# EAGLE design untitled (EAGLE 6.4)
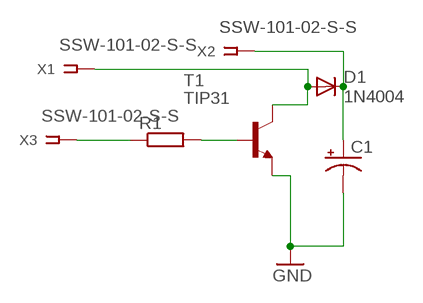
[diagram p0: schematic, sheet 1]

## Parts
C1  CPOL-USE5-5  [E5-5]
D1  1N4004  [DO41-10]
R1  R-EU_0207/10  [0207/10]
T1  TIP31  [TO220]
X1  SSW-101-02-S-S  [SSW-101-02-S-S]
X2  SSW-101-02-S-S  [SSW-101-02-S-S]
X3  SSW-101-02-S-S  [SSW-101-02-S-S]

## Nets
GND: C1.- T1.3(E)
N$1: R1.2 T1.1(B)
N$2: D1.A T1.2(C) X1.1
N$3: C1.+ D1.C X2.1
N$4: R1.1 X3.1

## Library data of the parts
C1 = rcl:CPOL-US: POLARIZED CAPACITOR, American symbol
D1 = diode:1N4004: DIODE general purpose rectifier, 1 A
R1 = rcl:R-EU_: RESISTOR, European symbol
T1 = transistor:TIP31: NPN Transistor Medium Power Linear Switching Applications Source: http://onsemi.com
X1-X3 = con-samtec:SSW-101-02-S-S: THROUGH-HOLE .025" SQ POST SOCKET Source: Samtec SSW.pdf; MPN: SSW-101-02-S-S; OC_FARNELL: unknown; OC_NEWARK: 11P9336

## Board
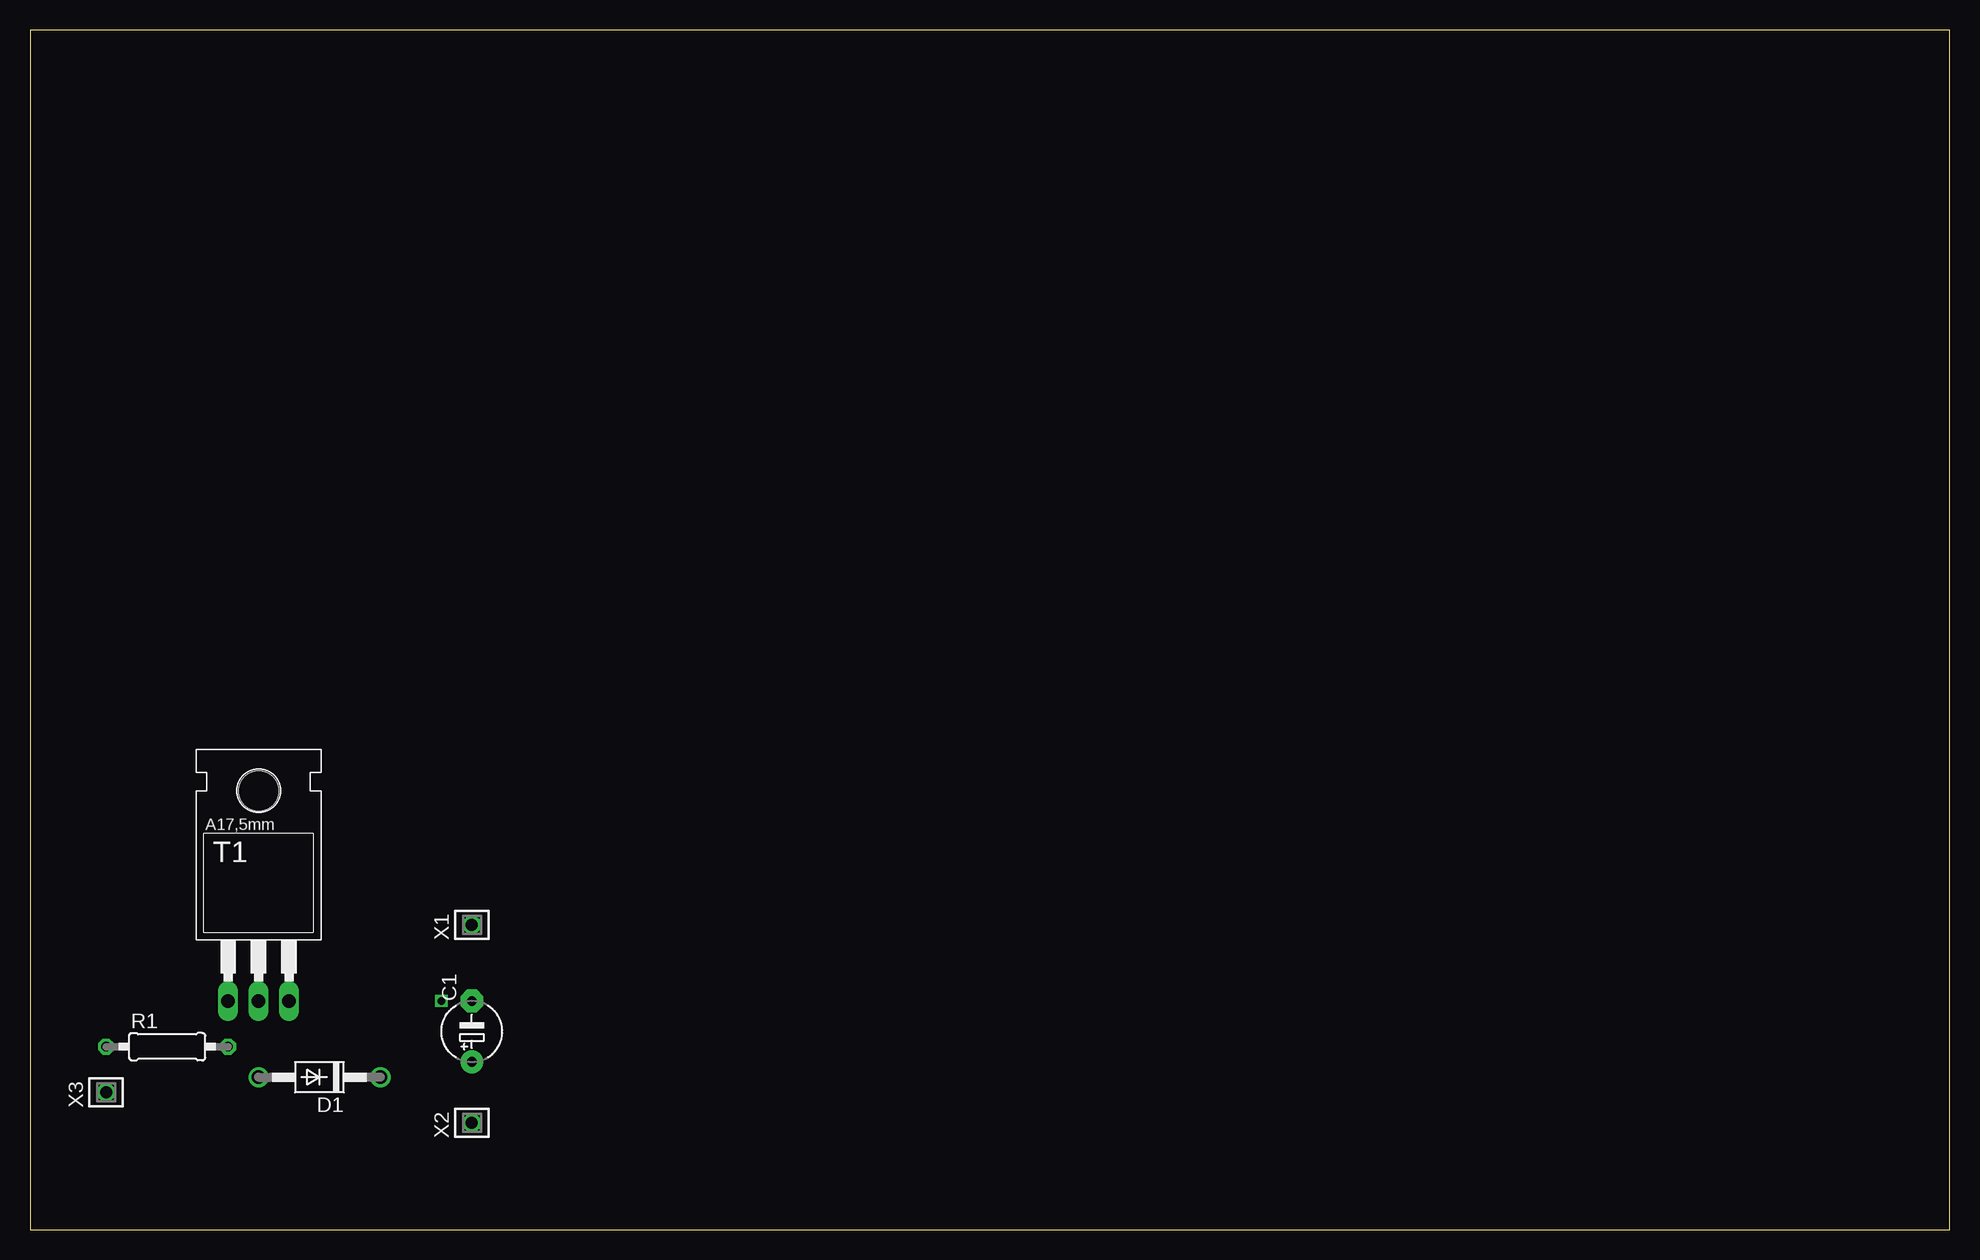
[diagram p1: board, top side]
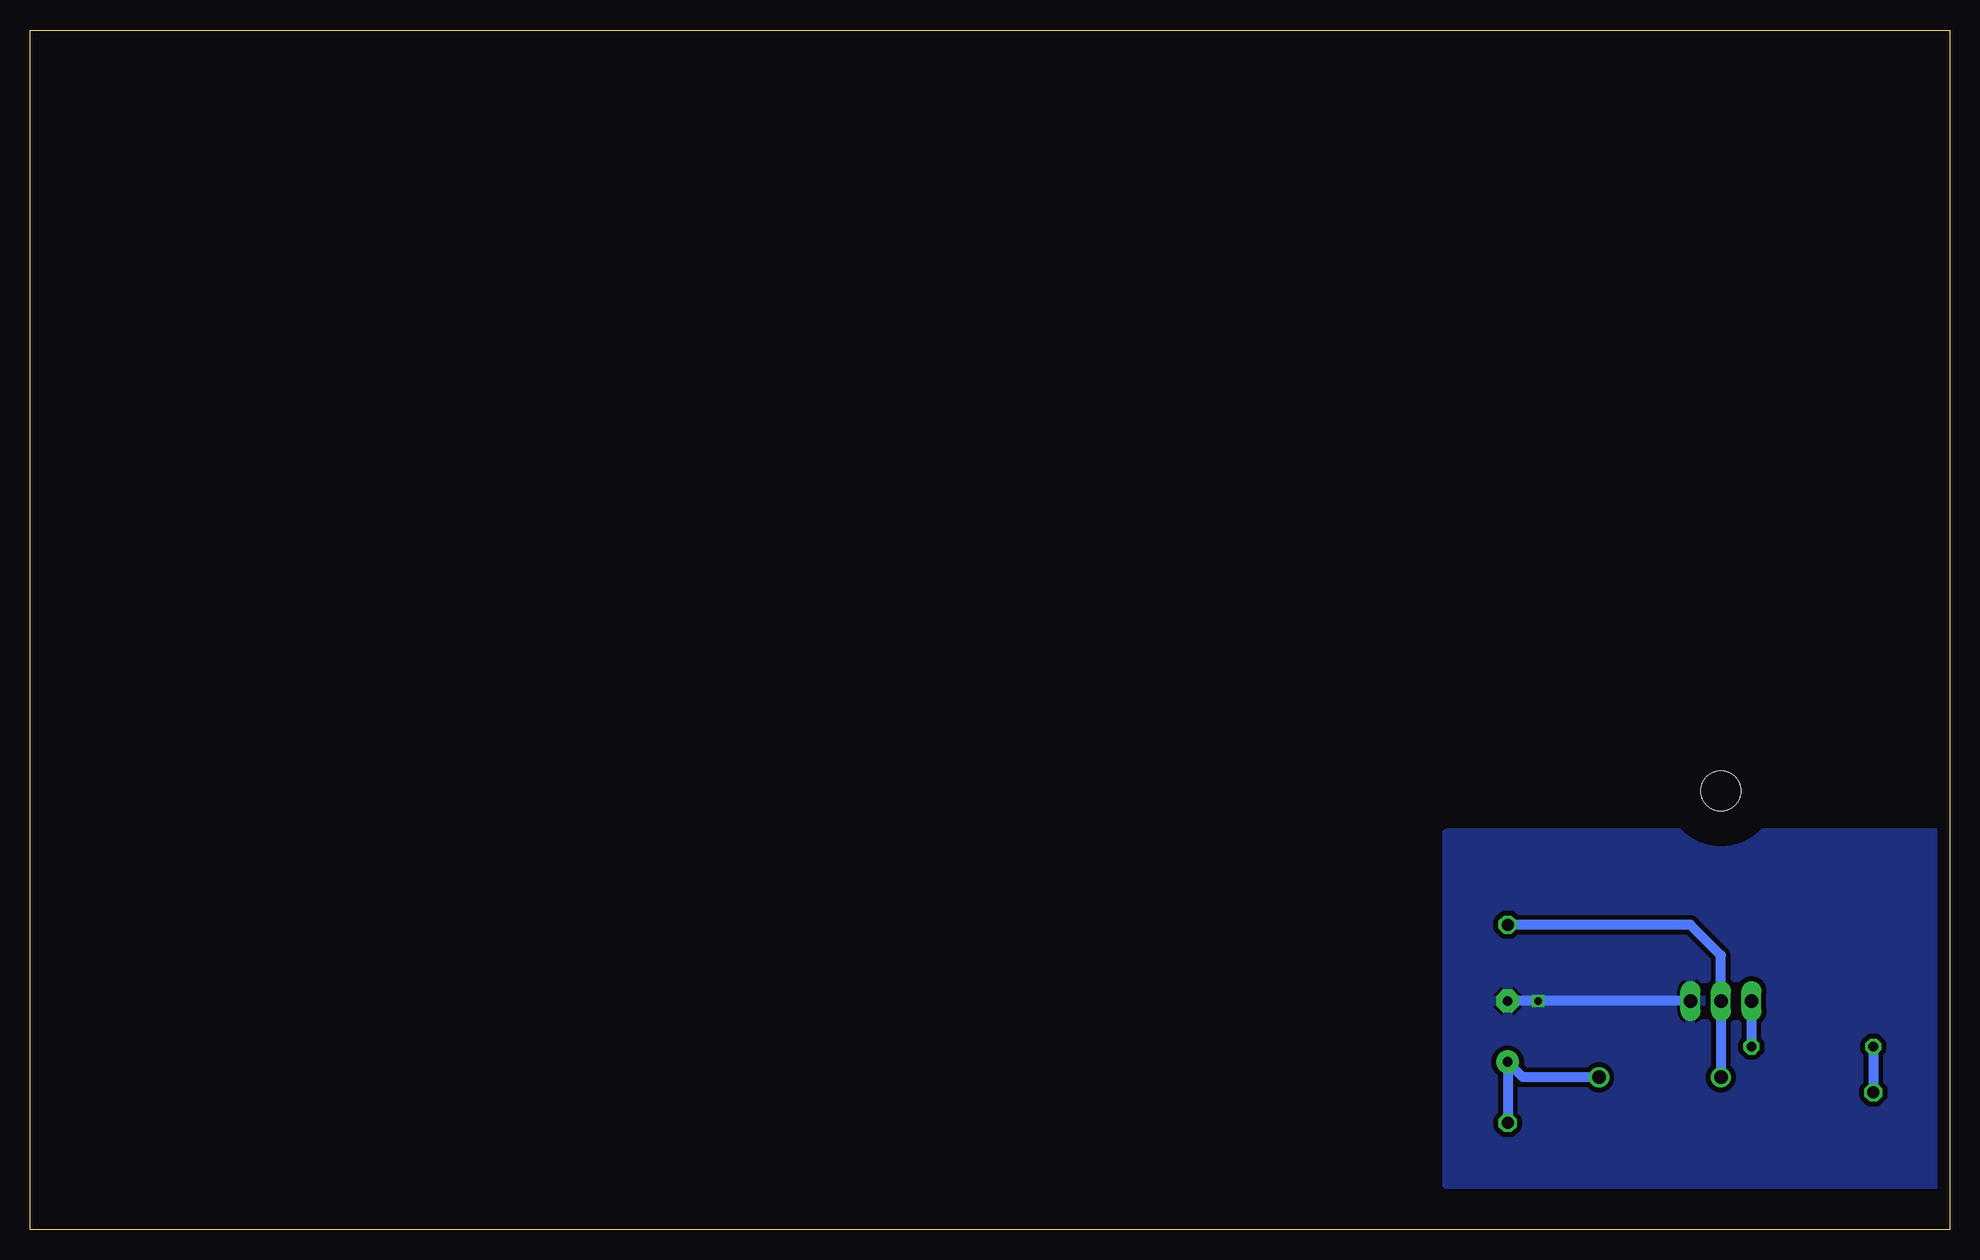
[diagram p2: board, bottom side, seen from below]

Size 160 x 100 mm. Coordinates in mm from the lower left corner, seen from the top.
Outline: 0,0 160,0 160,100 0,100 0,0
Copper layers (1*16): Top 0.035mm / dielectric 1.5mm / Bottom 0.035mm
Design rules "default": minimum track width 10mil, minimum drill 24mil, track to track 8mil, track to pad 8mil, pad to pad 8mil, via to via 8mil, smd to smd 8mil, copper to edge 40mil, drill to drill 8mil, minimum pad ring 10mil, minimum via ring 8mil, stop-mask expansion 4mil, vias tented up to drill 0mil, thermal gap 10mil

### Footprints (pad centres in the part's own frame; a part is rotated, then mirrored left to right if it is on the bottom)
E5-5 = drill 0.813 pad 1.905: + -2.54,0 | drill 0.813 pad 1.905 octagon: - 2.54,0
DO41-10 = drill 1.118: A 5.08,0; C -5.08,0
0207/10 = drill 0.813 octagon: 1 -5.08,0; 2 5.08,0
TO220 = drill 1.118 long: 1 -2.54,-6.35; 2 0,-6.35; 3 2.54,-6.35 | hole 3.302: 0,11.176
SSW-101-02-S-S = drill 1 pad 1.5 octagon: 1 0,0

### Placement (x,y rotation side)
C1  36.83,16.51 90 top
D1  24.13,12.7 180 top
R1  11.43,15.24 0 top
T1  19.05,25.4 0 top
X1  36.83,25.4 0 top
X2  36.83,8.89 0 top
X3  6.35,11.43 0 top

### Tracks (layer width: path | path; a pad name or v marks a point on that pad's centre or on a via)
GND  (via drill 0.6)
  Bottom 0.813: T1.3 v34.29,19.05 C1.-
  pour Bottom (isolate 0.406): 0,33.02 41.91,33.02 41.91,31.75 41.91,3.81 0,3.81 0,5.08
N$1
  Bottom 0.813: T1.1 R1.2
N$2
  Bottom 0.813: D1.A T1.2 19.05,22.86 21.59,25.4 X1.1
N$3
  Bottom 0.813: X2.1 C1.+ 35.56,12.7 D1.C
N$4
  Bottom 0.813: R1.1 X3.1